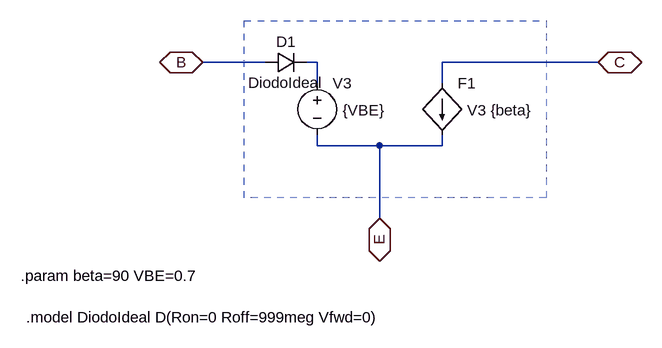
[diagram p0: schematic BJT_ideal.asc]
BJT_ideal.asc, the LTspice schematic file:
Version 4
SHEET 1 1008 728
WIRE 96 -416 0 -416
WIRE 176 -416 160 -416
WIRE 608 -416 368 -416
WIRE 176 -384 176 -416
WIRE 368 -384 368 -416
WIRE 176 -288 176 -304
WIRE 272 -288 176 -288
WIRE 368 -288 368 -304
WIRE 368 -288 272 -288
WIRE 272 -176 272 -288
FLAG 0 -416 B
IOPIN 0 -416 BiDir
FLAG 272 -176 E
IOPIN 272 -176 BiDir
FLAG 608 -416 C
IOPIN 608 -416 BiDir
SYMBOL voltage 176 -400 R0
WINDOW 123 0 0 Left 0
WINDOW 39 0 0 Left 0
WINDOW 3 39 58 Left 2
SYMATTR Value {VBE}
SYMATTR InstName V3
SYMBOL f 368 -384 R0
WINDOW 3 39 42 Left 2
SYMATTR Value V3 {beta}
SYMATTR InstName F1
SYMBOL diode 96 -400 R270
WINDOW 0 32 32 VTop 2
WINDOW 3 0 32 VBottom 2
SYMATTR InstName D1
SYMATTR Value DiodoIdeal
TEXT -280 -88 Left 2 !.param beta=90 VBE=0.7
TEXT -272 -24 Left 2 !.model DiodoIdeal D(Ron=0 Roff=999meg Vfwd=0)
RECTANGLE Normal 528 -208 64 -480 2

The netlist it stands for:
* BJT_ideal.asc
V3 N001 E {VBE}
F1 C E V3 {beta}
D1 B N001 DiodoIdeal
.model D D
.lib standard.dio
.param beta=90 VBE=0.7
.model DiodoIdeal D(Ron=0 Roff=999meg Vfwd=0)
.backanno
.end